# EAGLE design relays_board_6_1_0 (EAGLE 5.07)
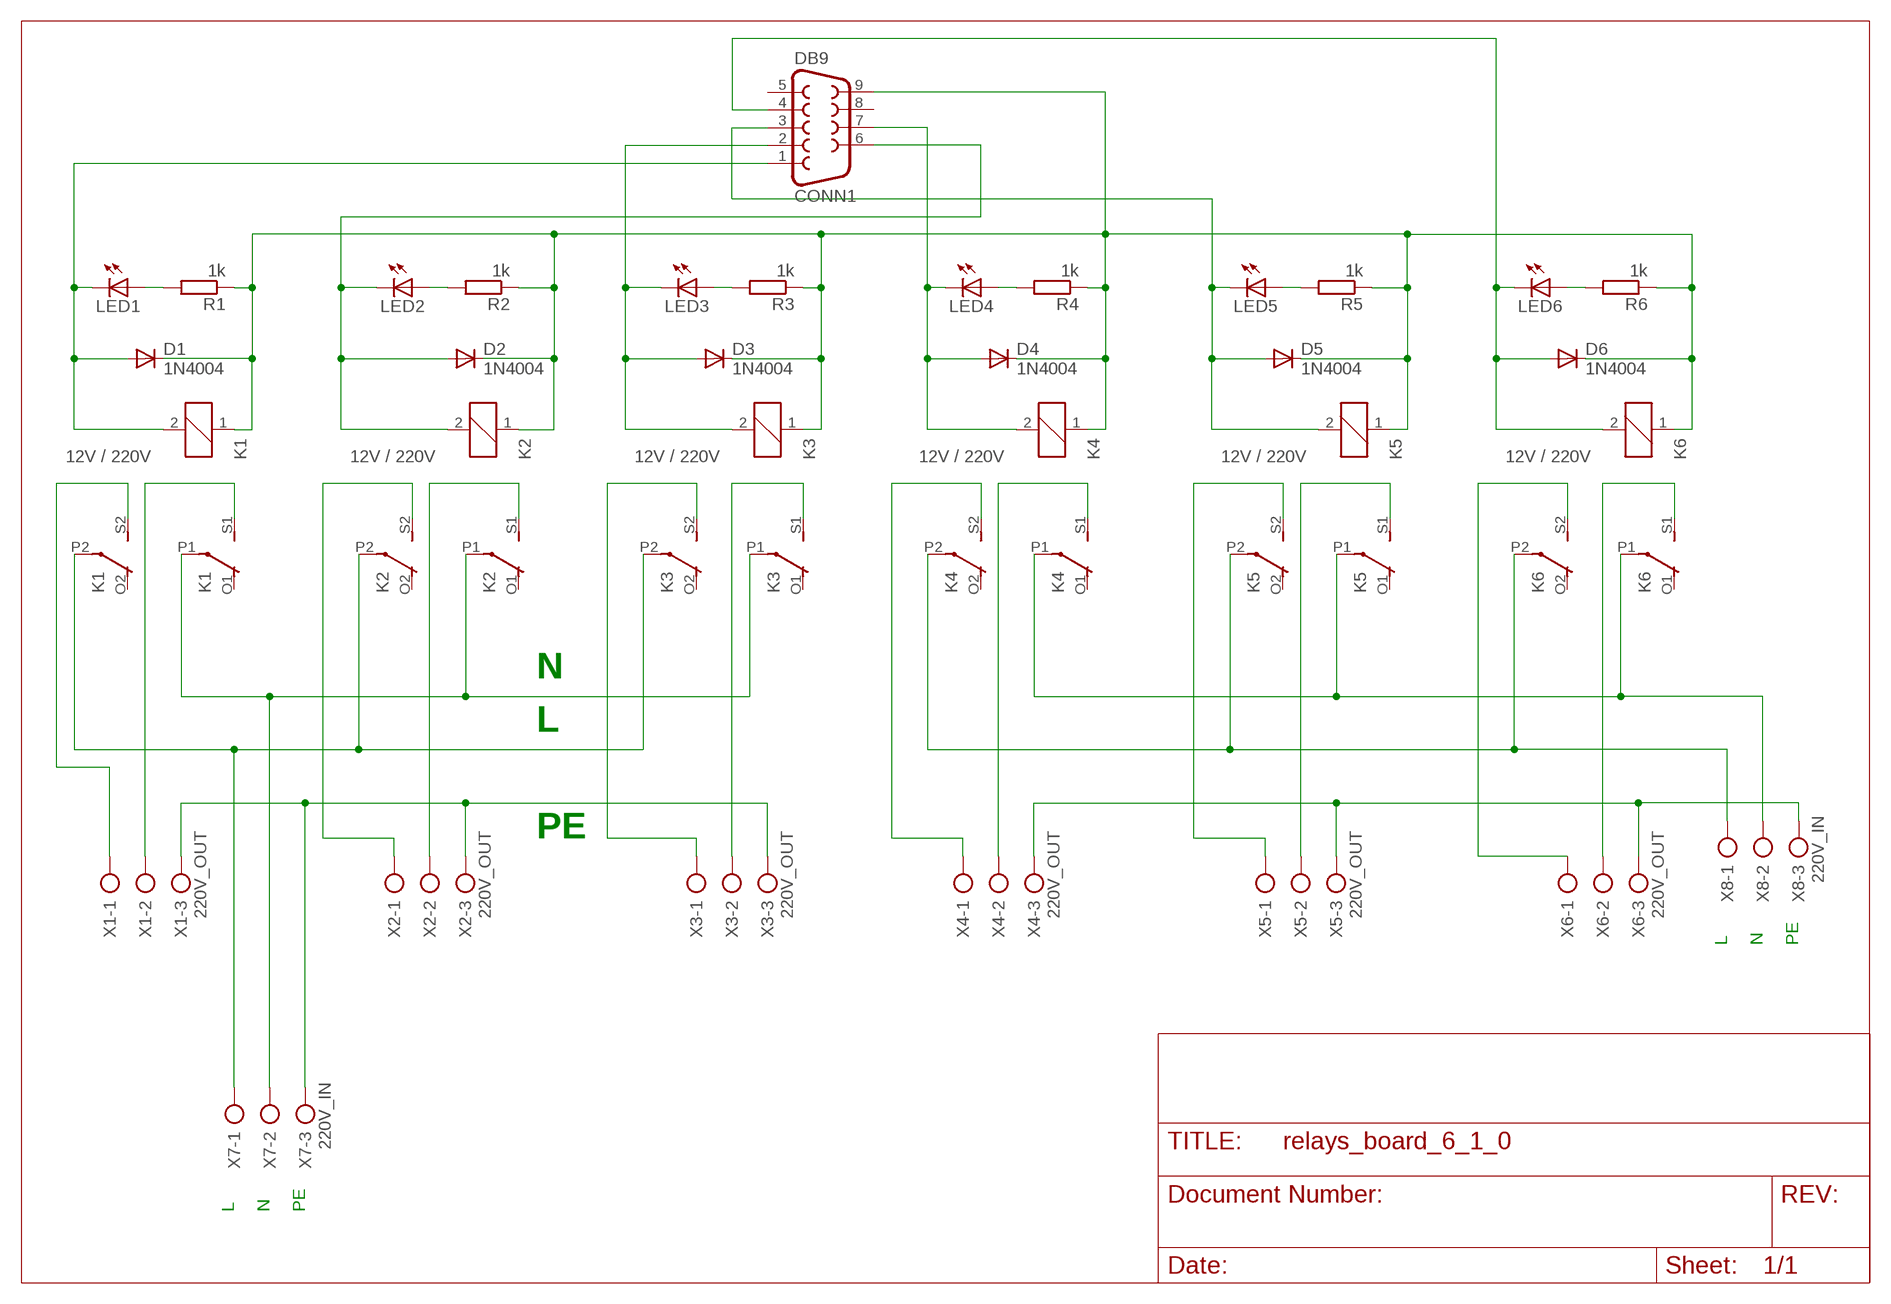
[diagram p0: schematic, sheet 1]

## Parts
CONN1  DB9  F09H  [F09H]
D1  1N4004  [DO41-10]
D2  1N4004  [DO41-10]
D3  1N4004  [DO41-10]
D4  1N4004  [DO41-10]
D5  1N4004  [DO41-10]
D6  1N4004  [DO41-10]
K1  12V / 220V  4052  [F4052]
K2  12V / 220V  4052  [F4052]
K3  12V / 220V  4052  [F4052]
K4  12V / 220V  4052  [F4052]
K5  12V / 220V  4052  [F4052]
K6  12V / 220V  4052  [F4052]
LED1  LEDCHIP-LED0805  [CHIP-LED0805]
LED2  LEDCHIP-LED0805  [CHIP-LED0805]
LED3  LEDCHIP-LED0805  [CHIP-LED0805]
LED4  LEDCHIP-LED0805  [CHIP-LED0805]
LED5  LEDCHIP-LED0805  [CHIP-LED0805]
LED6  LEDCHIP-LED0805  [CHIP-LED0805]
R1  1k  R-EU_0207/2V  [0207/2V]
R2  1k  R-EU_0207/2V  [0207/2V]
R3  1k  R-EU_0207/2V  [0207/2V]
R4  1k  R-EU_0207/2V  [0207/2V]
R5  1k  R-EU_0207/2V  [0207/2V]
R6  1k  R-EU_0207/2V  [0207/2V]
X1  220V_OUT  AK500/3  [AK500/3]
X2  220V_OUT  AK500/3  [AK500/3]
X3  220V_OUT  AK500/3  [AK500/3]
X4  220V_OUT  AK500/3  [AK500/3]
X5  220V_OUT  AK500/3  [AK500/3]
X6  220V_OUT  AK500/3  [AK500/3]
X7  220V_IN  AK500/3  [AK500/3]
X8  220V_IN  AK500/3  [AK500/3]

## Nets
+12V: CONN1.9 D1.C D2.C D3.C D4.C D5.C D6.C K1.1 K2.1 K3.1 K4.1 K5.1 K6.1 R1.1 R2.1 R3.1 R4.1 R5.1 R6.1
L: K1.P2(3:P) K2.P2(3:P) K3.P2(3:P) X7.1
L2: K4.P2(3:P) K5.P2(3:P) K6.P2(3:P) X8.1
N: K1.P1(2:P) K2.P1(2:P) K3.P1(2:P) X7.2
N2: K4.P1(2:P) K5.P1(2:P) K6.P1(2:P) X8.2
N$1: LED1.A R1.2
N$2: LED2.A R2.2
N$3: LED3.A R3.2
N$4: LED4.A R4.2
N$5: LED5.A R5.2
N$6: LED6.A R6.2
N$19: K1.S2(3:S) X1.1
N$24: K1.S1(2:S) X1.2
N$26: K2.S2(3:S) X2.1
N$27: K2.S1(2:S) X2.2
N$28: K3.S2(3:S) X3.1
N$29: K3.S1(2:S) X3.2
N$30: K4.S2(3:S) X4.1
N$31: K4.S1(2:S) X4.2
N$32: K5.S2(3:S) X5.1
N$33: K5.S1(2:S) X5.2
N$34: K6.S2(3:S) X6.1
N$35: K6.S1(2:S) X6.2
N$36: CONN1.1 D1.A K1.2 LED1.C
N$38: CONN1.6 D2.A K2.2 LED2.C
N$40: CONN1.2 D3.A K3.2 LED3.C
N$42: CONN1.7 D4.A K4.2 LED4.C
N$44: CONN1.3 D5.A K5.2 LED5.C
N$46: CONN1.4 D6.A K6.2 LED6.C
PE: X1.3 X2.3 X3.3 X7.3
PE2: X4.3 X5.3 X6.3 X8.3
Unconnected: CONN1.5 CONN1.8 K1.O1(2:O) K1.O2(3:O) K2.O1(2:O) K2.O2(3:O) K3.O1(2:O) K3.O2(3:O) K4.O1(2:O) K4.O2(3:O) K5.O1(2:O) K5.O2(3:O) K6.O1(2:O) K6.O2(3:O)

## Notes on the sheet
- N
- L
- PE
- L | N | PE
- L | N | PE

## Library data of the parts
CONN1 = my_library:F09: SUB-D
D1-D6 = my_library:1N4004: DIODE general purpose rectifier, 1 A
K1-K6 = relay:4052: RELAY 2 x switch, Finder
LED1-LED6 = led:LED: LED OSRAM: - CHIPLED LG R971, LG N971, LY N971, LG Q971, LY Q971, LO R971, LY R971 LH N974, LH R974 LS Q976, LO Q976, LY Q976 LO Q996 - Hyper CHIPLED LW Q18S LB Q993, LB Q99A, LB R99A - SideLED LS A670, LO A670, LY A670, LG A670, LP A670 LB A673, LV A673, LT A673, LW A673 LH A674 LY A675 LS A676, LA A676, LO A676, LY A676, LW A676 LS A679, LY A679, LG A679 - Hyper Micro SIDELED® LS Y876, LA Y876, LO Y876, LY Y876 LT Y87S - SmartLED LW L88C, LW L88S LB L89C, LB L89S, LG L890 LS L89K, LO L89K, LY L89K LS L896, LA L896, LO L896, LY L896 - TOPLED LS T670, LO T670, LY T670, LG T670, LP T670 LSG T670, LSP T670, LSY T670, LOP T670, LYG T670 LG T671, LOG T671, LSG T671 LB T673, LV T673, LT T673, LW T673 LH T674 LS T676, LA T676, LO T676, LY T676, LB T676, LH T676, LSB T676, LW T676 LB T67C, LV T67C, LT T67C, LS T67K, LO T67K, LY T67K, LW E67C LS E67B, LA E67B, LO E67B, LY E67B, LB E67C, LV E67C, LT E67C LW T67C LS T679, LY T679, LG T679 LS T770, LO T770, LY T770, LG T770, LP T770 LB T773, LV T773, LT T773, LW T773 LH T774 LS E675, LA E675, LY E675, LS T675 LS T776, LA T776, LO T776, LY T776, LB T776 LHGB T686 LT T68C, LB T68C - Hyper Mini TOPLED® LB M676 - Mini TOPLED Santana® LG M470 LS M47K, LO M47K, LY M47K Source: http://www.osram.convergy.de LUXEON: - LUMILED® LXK2-PW12-R00, LXK2-PW12-S00, LXK2-PW14-U00, LXK2-PW14-V00 LXK2-PM12-R00, LXK2-PM12-S00, LXK2-PM14-U00 LXK2-PE12-Q00, LXK2-PE12-R00, LXK2-PE12-S00, LXK2-PE14-T00, LXK2-PE14-U00 LXK2-PB12-K00, LXK2-PB12-L00, LXK2-PB12-M00, LXK2-PB14-N00, LXK2-PB14-P00, LXK2-PB14-Q00 LXK2-PR12-L00, LXK2-PR12-M00, LXK2-PR14-Q00, LXK2-PR14-R00 LXK2-PD12-Q00, LXK2-PD12-R00, LXK2-PD12-S00 LXK2-PH12-R00, LXK2-PH12-S00 LXK2-PL12-P00, LXK2-PL12-Q00, LXK2-PL12-R00 Source: www.luxeon.com KINGBRIGHT: KA-3528ASYC Source: www.kingbright.com
R1-R6 = my_library:R-EU_: RESISTOR, European symbol
X1-X8 = con-ptr500:AK500/3: CONNECTOR

## Board
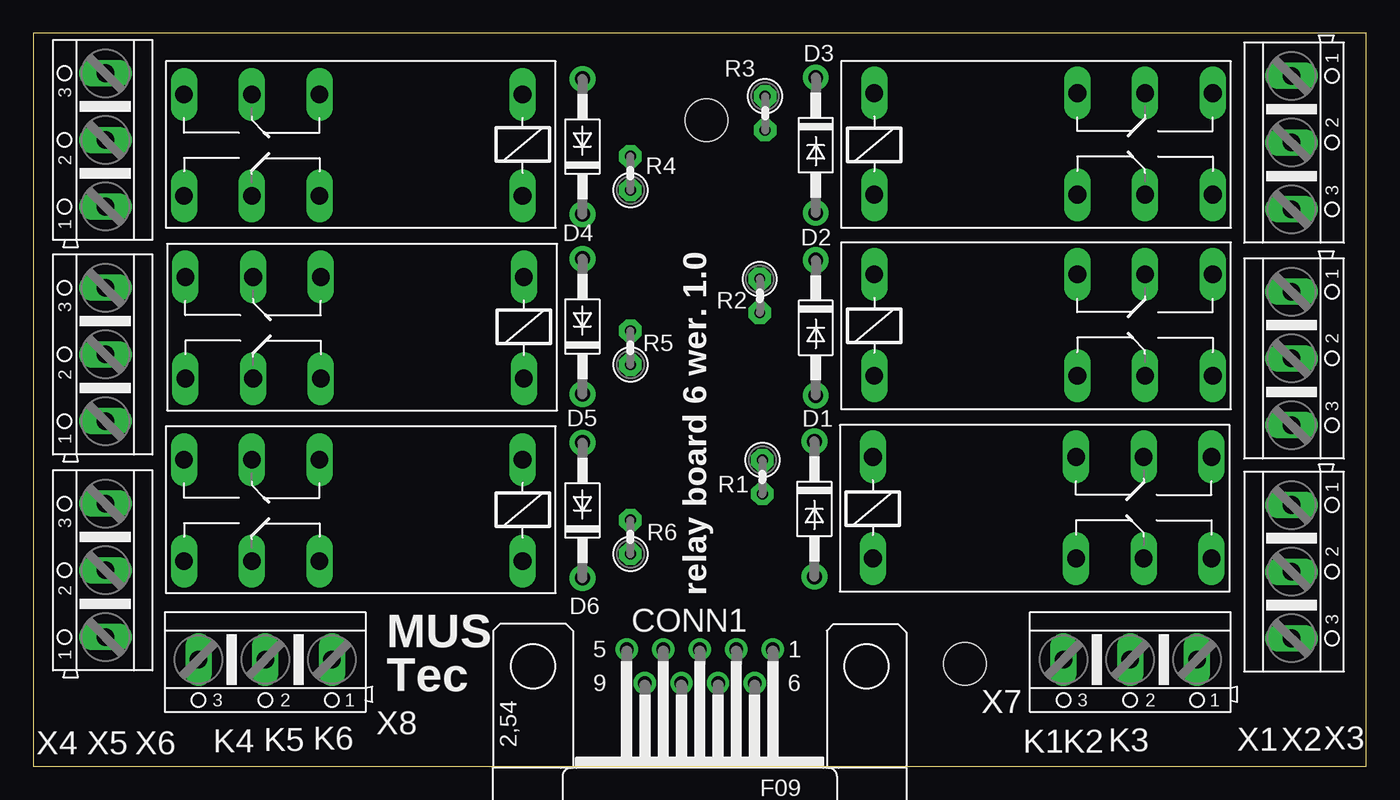
[diagram p1: board, top side]
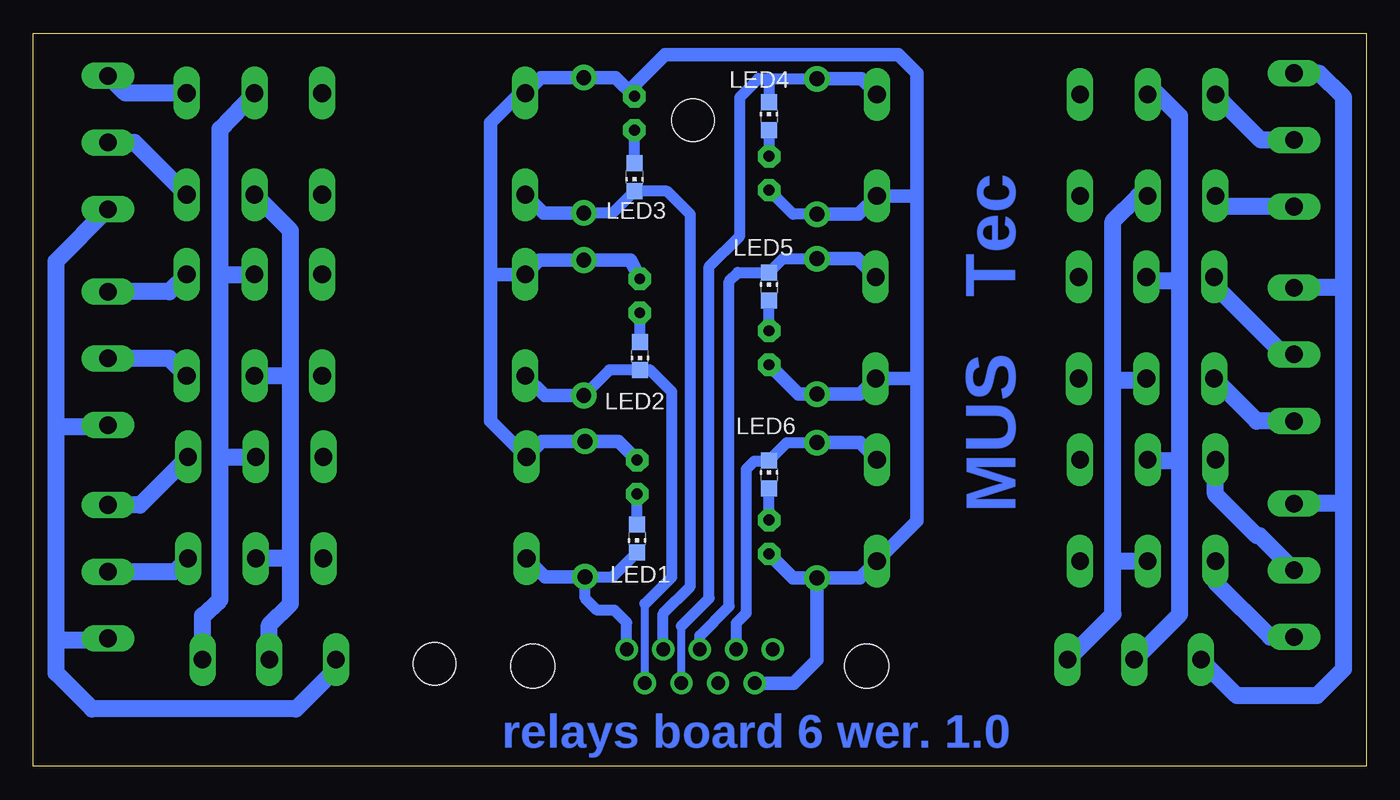
[diagram p2: board, bottom side, seen from below]

Size 100 x 55 mm. Coordinates in mm from the lower left corner, seen from the top.
Outline: 0,0 100,0 100,55 0,55 0,0
Copper layers (1*16): Top 0.035mm / dielectric 1.5mm / Bottom 0.035mm
Design rules "default": minimum track width 10mil, minimum drill 24mil, track to track 8mil, track to pad 8mil, pad to pad 8mil, via to via 8mil, smd to smd 8mil, copper to edge 40mil, drill to drill 8mil, minimum pad ring 10mil, minimum via ring 8mil, stop-mask expansion 4mil, vias tented up to drill 0mil, thermal gap 10mil
Holes 3.2 mm at 69.9,7.7 50.5,48.5

### Footprints (pad centres in the part's own frame; a part is rotated, then mirrored left to right if it is on the bottom)
F09H = drill 1.016 pad 1.676 round: 1 -5.486,-1.27; 2 -2.743,-1.27; 3 0,-1.27; 4 2.743,-1.27; 5 5.486,-1.27; 6 -4.115,1.27; 7 -1.372,1.27; 8 1.372,1.27; 9 4.115,1.27 | hole 3.302: -12.522,0; 12.522,0
DO41-10 = drill 1.118 pad 1.93 round: A 5.08,0; C -5.08,0
F4052 = drill 1.321 long: 1 -3.81,3.81; 2 -3.81,-3.81; O1 11.43,-3.81; O2 11.43,3.81; P1 16.51,-3.81; P2 16.51,3.81; S1 21.59,-3.81; S2 21.59,3.81
CHIP-LED0805 = smd 1.2 x 1.2: A 0,-1.05; C 0,1.05
0207/2V = drill 0.813 pad 1.676 octagon: 1 -1.27,0; 2 1.27,0
AK500/3 = drill 1.321 long: 1 -5.004,0; 2 0,0; 3 5.004,0

### Placement (x,y rotation side)
CONN1  50,7.5 180 top
D1  58.6,19.3 270 top
D2  58.7,32.9 270 top
D3  58.7,46.6 270 top
D4  41.2,46.5 90 top
D5  41.2,33 90 top
D6  41.2,19.2 90 top
K1  66.8,19.4 0 top
K2  66.9,33.1 0 top
K3  66.9,46.7 0 top
K4  32.9,46.6 180 top
K5  33,32.9 180 top
K6  32.9,19.2 180 top
LED1  54.7,17.1 180 bottom
LED2  54.5,30.8 180 bottom
LED3  54.9,44.2 180 bottom
LED4  44.8,48.8 0 bottom
LED5  44.8,36 0 bottom
LED6  44.8,21.9 0 bottom
R1  54.7,21.7 270 top
R2  54.5,35.3 270 top
R3  54.9,49 270 top
R4  44.8,44.5 90 top
R5  44.8,31.4 90 top
R6  44.8,17.2 90 top
X1  94.4,14.6 270 top
X2  94.4,30.6 270 top
X3  94.4,46.8 270 top
X4  5.4,47 90 top
X5  5.4,30.9 90 top
X6  5.4,14.7 90 top
X7  82.3,8 180 top
X8  17.4,8 180 top

### Tracks (layer width: path | path; a pad name or v marks a point on that pad's centre or on a via)
+12V
  Bottom 0.813: D4.C 42.99,41.42 R4.1
  Bottom 1.016: CONN1.9 42.97,6.23 41.2,8 D6.C | D6.C 37.98,14.12 K6.1 33.7,18.4 33.7,29.1 | 33.7,29.1 33.7,42.8 | 33.7,42.8 33.7,52 35.1,53.4 52.6,53.4 54.9,51.1 R3.1 56.31,51.68 D3.C 61.92,51.68 K3.1 63.49,50.51 65.7,48.3 65.7,36.7 | 33.7,42.8 33.71,42.79 K4.1 38.08,41.42 D4.C | 33.7,29.1 33.71,29.09 K5.1 37.98,27.92 D5.C 42.59,27.92 R5.1 | 65.7,36.7 65.7,25.92 K1.1 61.82,24.38 D1.C 56.11,24.38 R1.1 | 65.7,36.7 65.49,36.91 K2.1 62.02,37.98 D2.C 55.21,37.98 R2.1 | R6.1 42.99,14.12 D6.C
L
  Bottom 1.27: X7.1 87.3,11.3 86,12.5 86,23.1 | 86,23.1 86,36.7 | 86,36.7 86,47.82 K3.P2 | K2.P2 85.79,36.91 86,36.7 | K1.P2 85.89,23.21 86,23.1
L2
  Bottom 1.27: X8.1 19,11.4 19,15.4 | 19,15.4 19,29 | 19,29 19,40.9 17.11,42.79 K4.P2 | K5.P2 16.58,29 19,29 | K6.P2 19,15.4
N
  Bottom 1.27: X7.2 82.3,10.6 80.7,12.2 80.7,15.7 | 80.7,15.7 80.7,29.2 | 80.7,29.2 80.7,40.18 K3.P1 | K2.P1 80.79,29.29 80.7,29.2 | K1.P1 80.81,15.59 80.7,15.7
N2
  Bottom 1.27: X8.2 14,11.4 14,22.9 | 14,22.9 14,36.4 | 14,36.4 14,48.8 15.61,50.41 K4.P1 | K5.P1 16.18,36.4 14,36.4 | K6.P1 16.28,22.9 14,22.9
N$1
  Bottom 0.813: LED1.A R1.2
N$2
  Bottom 0.813: LED2.A R2.2
N$3
  Bottom 0.813: LED3.A R3.2
N$4
  Bottom 0.813: LED4.A R4.2
N$5
  Bottom 0.813: R5.2 LED5.A
N$6
  Bottom 0.813: R6.2 LED6.A
N$19
  Bottom 1.27: K1.S2 92,19.6 X1.1
N$24
  Bottom 1.27: K1.S1 89.38,14.6 X1.2
N$26
  Bottom 1.27: K2.S2 89.8,35.6 X2.1
N$27
  Bottom 1.27: K2.S1 89.8,30.6 X2.2
N$28
  Bottom 1.27: K3.S2 93.11,50.51 X3.1
N$29
  Bottom 1.27: K3.S1 92.4,46.8 X3.2
N$30
  Bottom 1.27: K4.S2 10.52,42 X4.1
N$31
  Bottom 1.27: K4.S1 7.9,47 X4.2
N$32
  Bottom 1.27: K5.S2 8.22,25.9 X5.1
N$33
  Bottom 1.27: K5.S1 11.41,36.11 6,30.7 5.6,30.7 X5.2
N$34
  Bottom 1.27: K6.S2 11.31,13.81 7.2,9.7 X6.1
N$35
  Bottom 1.27: K6.S1 11.31,20.41 8.2,17.3 8,17.3 X6.2
N$36
  Bottom 0.813: CONN1.1 55.49,10.79 56.4,11.7 57.7,11.7 58.6,12.6 D1.A 56.53,14.22 LED1.C
  Bottom 1.016: K1.2 61.62,14.22 D1.A
N$38
  Bottom 0.61: CONN1.6 54.12,12.19
  Bottom 0.813: 54.12,12.19 52.1,14.2 52.1,28.1 53.75,29.75 LED2.C 56.77,29.75 D2.A
  Bottom 1.016: K2.2 61.62,27.82 D2.A
N$40
  Bottom 0.813: CONN1.2 52.74,11.46 50.7,13.5 50.7,41.4 52.45,43.15 LED3.C 56.53,41.52 D3.A
  Bottom 1.016: K3.2 61.72,41.52 D3.A
N$42
  Bottom 0.61: CONN1.7 51.37,10.53
  Bottom 0.813: 51.37,10.53 49.3,12.6 49.3,37.5 47,39.8 47,50.2 45.6,51.6 44.7,51.6 | 44.7,51.6 41.22,51.6 D4.A | LED4.C 44.8,51.5 44.7,51.6
  Bottom 1.016: K4.2 37.88,51.58 D4.A
N$44
  Bottom 0.813: CONN1.3 50,9.8 47.8,12 47.8,36.4 47.15,37.05 LED5.C 43.77,38.08 D5.A
  Bottom 1.016: K5.2 38.18,38.08 D5.A
N$46
  Bottom 0.813: CONN1.4 47.26,10.74 46.5,11.5 46.5,22.3 45.9,22.9 44.85,22.9 LED6.C 43.47,24.28 D6.A
  Bottom 1.016: K6.2 37.98,24.28 D6.A
PE
  Bottom 1.27: X3.3 98.3,37.9 98.3,25.5 | 98.3,9.5 98.3,7 95.6,4.3 80.3,4.3 77.3,7.3 X7.3 | 98.3,9.5 98.3,25.5 | X1.3 94.5,9.5 98.3,9.5 | X2.3 94.5,25.5 98.3,25.5
PE2
  Bottom 1.27: X4.3 3.5,52 1.7,50.2 1.7,35.9 | 1.7,20.1 1.7,7.3 3.7,5.3 9.7,5.3 X8.3 | 1.7,20.1 1.7,35.9 | X6.3 2.1,19.7 1.7,20.1 | X5.3 1.7,35.9

### Text on the board
Bottom: Tec | MUS | relays board 6 wer. 1.0
tPlace: relay board 6 wer. 1.0 | MUS | Tec